# Altium schematic sheet 27-AudioEncode.SchDoc
size A4
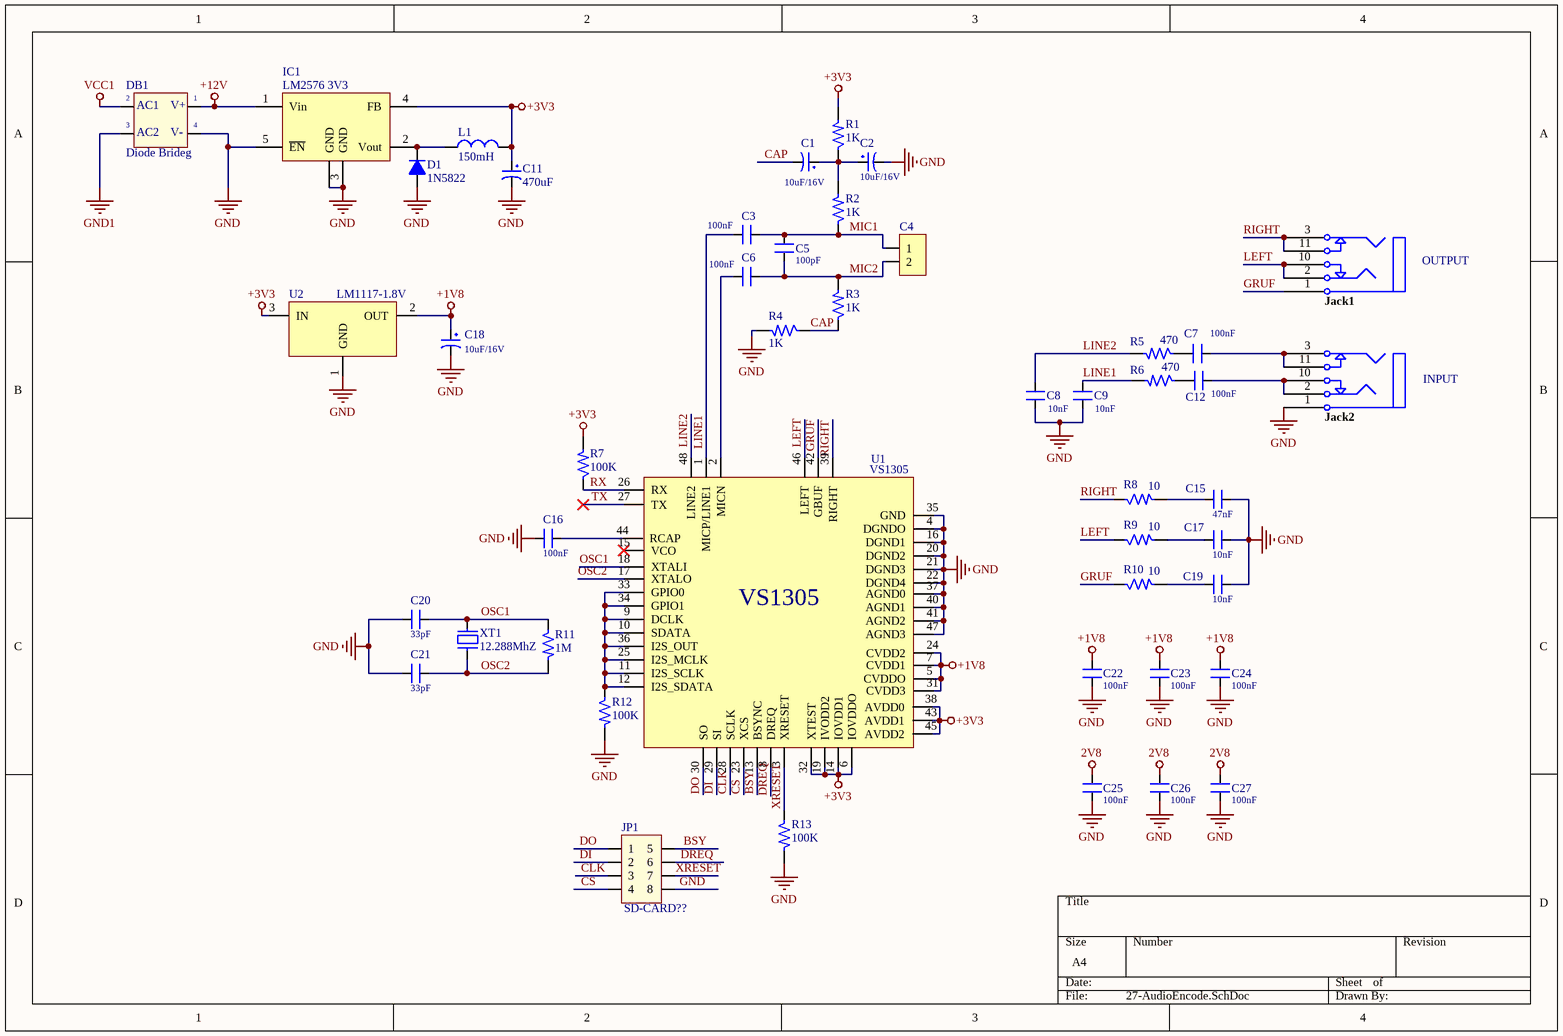
[diagram p0: 27-AudioEncode.SchDoc]

## Parts
C1  10uF/16V  [C-TANT-7343]
C2  10uF/16V  [C-TANT-7343]
C3  100nF  [CER-0805]
C4  JP2  [JP2-C1T]  (value not drawn)
C5  100pF  [CER-0805]
C6  100nF  [CER-0805]
C7  100nF  [CER-0805]
C8  10nF  [CER-0805]
C9  10nF  [CER-0805]
C11  470uF  [C-ALU-D6.5]
C12  100nF  [CER-0805]
C15  47nF  [CER-0805]
C16  100nF  [CER-0805]
C17  10nF  [CER-0805]
C18  10uF/16V  [C-TANT-7343]
C19  10nF  [CER-0805]
C20  33pF  [CER-0805]
C21  33pF  [CER-0805]
C22  100nF  [C-0805]
C23  100nF  [C-0805]
C24  100nF  [C-0805]
C25  100nF  [C-0805]
C26  100nF  [C-0805]
C27  100nF  [C-0805]
D1  1N5822  [D-DO214-AB]
DB1  Diode Brideg  [D-DB-1A-SMD]
IC1  LM2576 3V3  [TO-263-5L]
Jack1  AUDIO MIC BLACK HEADER  [CON MIC1]  (value not drawn)
Jack2  AUDIO MIC BLACK HEADER  [CON MIC1]  (value not drawn)
JP1  SD-CARD??  [JP4x2]
L1  150mH  [L-SMD-10x10]
R1  1K  [RES-0805]
R2  1K  [RES-0805]
R3  1K  [RES-0805]
R4  1K  [RES-0805]
R5  470  [RES-0805]
R6  470  [RES-0805]
R7  100K  [RES-0805]
R8  10  [RES-0805]
R9  10  [RES-0805]
R10  10  [RES-0805]
R11  1M  [RES-0805]
R12  100K  [RES-0805]
R13  100K  [RES-0805]
U1  VS1305  [QFP_48]
U2  LM1117-1.8V  [SOT223]
XT1  12.288MhZ  [XT SMD5032]

## Nets
2V8: C25.2 C26.2 C27.2
+1V8: C18.1 C22.2 C23.2 C24.2 U2.2(OUT)
+3V3: C11.1 IC1.4(FB) L1.2 R1.2 R7.2 U1.6(IOVDDO) U1.14(IOVDD1) U1.19(IVODD2) U1.32(XTEST) U2.3(IN)
+12V: DB1.3(AC2) IC1.1(Vin)
GND: C2.2 C8.1 C9.1 C11.2 C15.2 C16.1 C17.2 C18.2 C19.2 C20.1 C21.1 C22.1 C23.1 C24.1 C25.1 C26.1 C27.1 D1.1(A) DB1.4(-V_OUT) IC1.3(GND) IC1.5(~{EN}) IC1.HM(GND) Jack2.1 JP1.8 R4.2 R12.2 R13.2 U1.4(DGNDO) U1.16(DGND1) U1.20(DGND2) U1.21(DGND3) U1.22(DGND4) U1.35(GND) U1.37(AGND0) U1.40(AGND1) U1.41(AGND2) U1.47(AGND3) U2.1(GND)
GND1: DB1.1(+V_OUT)
VCC1: DB1.2(AC1)
BSY: JP1.5 U1.13(BSYNC)
CAP: C1.2 R3.1 R4.1
CLK: JP1.3 U1.28(SCLK)
CS: JP1.4 U1.23(XCS)
DI: JP1.2 U1.29(SI)
DO: JP1.1 U1.30(SO)
DREQ: JP1.6 U1.8(DREQ)
GRUF: Jack1.1 R10.1 U1.42(GBUF)
LEFT: Jack1.2 Jack1.10 R9.1 U1.46(LEFT)
LINE1: C3.2 C9.2 R6.2 U1.1(MICP/LINE1)
LINE2: C8.2 R5.2 U1.48(LINE2)
MIC1: C3.1 C4.1 C5.1 R2.1
MIC2: C4.2 C5.2 C6.1 R3.2
OSC1: C20.2 R11.1 U1.18(XTALI) XT1.2
OSC2: C21.2 R11.2 U1.17(XTALO) XT1.1
RIGHT: Jack1.3 Jack1.11 R8.1 U1.39(RIGHT)
RX: R7.1 U1.26(RX)
TX: U1.27(TX)
XRESET: JP1.7 R13.1 U1.3(XRESET)
NetC1_1: C1.1 C2.1 R1.1 R2.2
NetC6_2: C6.2 U1.2(MICN)
NetC7_1: C7.1 R5.1
NetC7_2: C7.2 Jack2.3 Jack2.11
NetC12_1: C12.1 R6.1
NetC12_2: C12.2 Jack2.2 Jack2.10
NetC15_1: C15.1 R8.2
NetC16_2: C16.2 U1.44(RCAP)
NetC17_1: C17.1 R9.2
NetC19_1: C19.1 R10.2
NetD1_2: D1.2(K) IC1.2(Vout) L1.1
NetR12_1: R12.1 U1.9(DCLK) U1.10(SDATA) U1.11(I2S_SCLK) U1.12(I2S_SDATA) U1.25(I2S_MCLK) U1.33(GPIO0) U1.34(GPIO1) U1.36(I2S_OUT)
NetU1_5: U1.5(CVDDO) U1.7(CVDD1) U1.24(CVDD2) U1.31(CVDD3)
NetU1_38: U1.38(AVDD0) U1.43(AVDD1) U1.45(AVDD2)

Not connected (* = marked no-connect by the designer): U1 15(VCO)*

## Notes on the sheet
- OUTPUT
- INPUT
- Labels drawn without touching a wire or pin: +1V8, +3V3
- (in symbol DB) V+; V-

## Library data of the parts
C1 C2 C18 = Capacitor
C3 C5-C9 C12 C15-C17 C19-C27 = Ceramic
C4 = JP2: WR-PHD 2.54 mm Angled Socket Header; Manufacturer: W¨¹rth Elektronik eiSos GmbH; partNo: 613002143121; ComponentLink1 Description: Manufacturer; ComponentLink2 Description: Datasheet; NoPins: 02; Created Date: 29 March 2013; ComponentLink1URL: http://www.we-online.com; ComponentLink2URL: http://katalog.we-online.de/em/datasheet/6130xx143121.pdf; Created by: Karrer Zheng
C11 = CP1: Cap P  0,1uF < 22uF , 16 - 50V; Value: 10uF/50V; Description 1: 10 => 220uF/6,3V/10V - 10uF => 100uF/16V; Description 2: 0,1uF => 33uF/50V - 10uF => 22uF/63V; Description 3: 0,47uF => 10uF/100V
D1 = D1A: Diode 1A; Value: 1N4007
DB1 = DB: Convert AC to DC voltage, 4 pin; Value: Cau 1A
IC1 = LM2576
Jack1 Jack2 = CON MIC1: Connector, 3.5mm Stereo Audio Socket, Black, 2 break contacts (normals) and 2 auxiliary make contacts; Connector type: AUDIO BLACK HEADER; Category: Connector; Status: Production
JP1 = JP4x2: Connector 4x2; Value: Connector 4x2
L1 = L1: Inductor; Value: 150 mH
R1-R13 = Res1/4W
U2 = LM1117: 800mA Low-Dropout Linear Regulator; Creator: Nguyen Ba Bien; Website: http://group3i.net
XT1 = XT